# EAGLE design MakePython A9G GPS Tracker V1.1 (EAGLE 6.1)
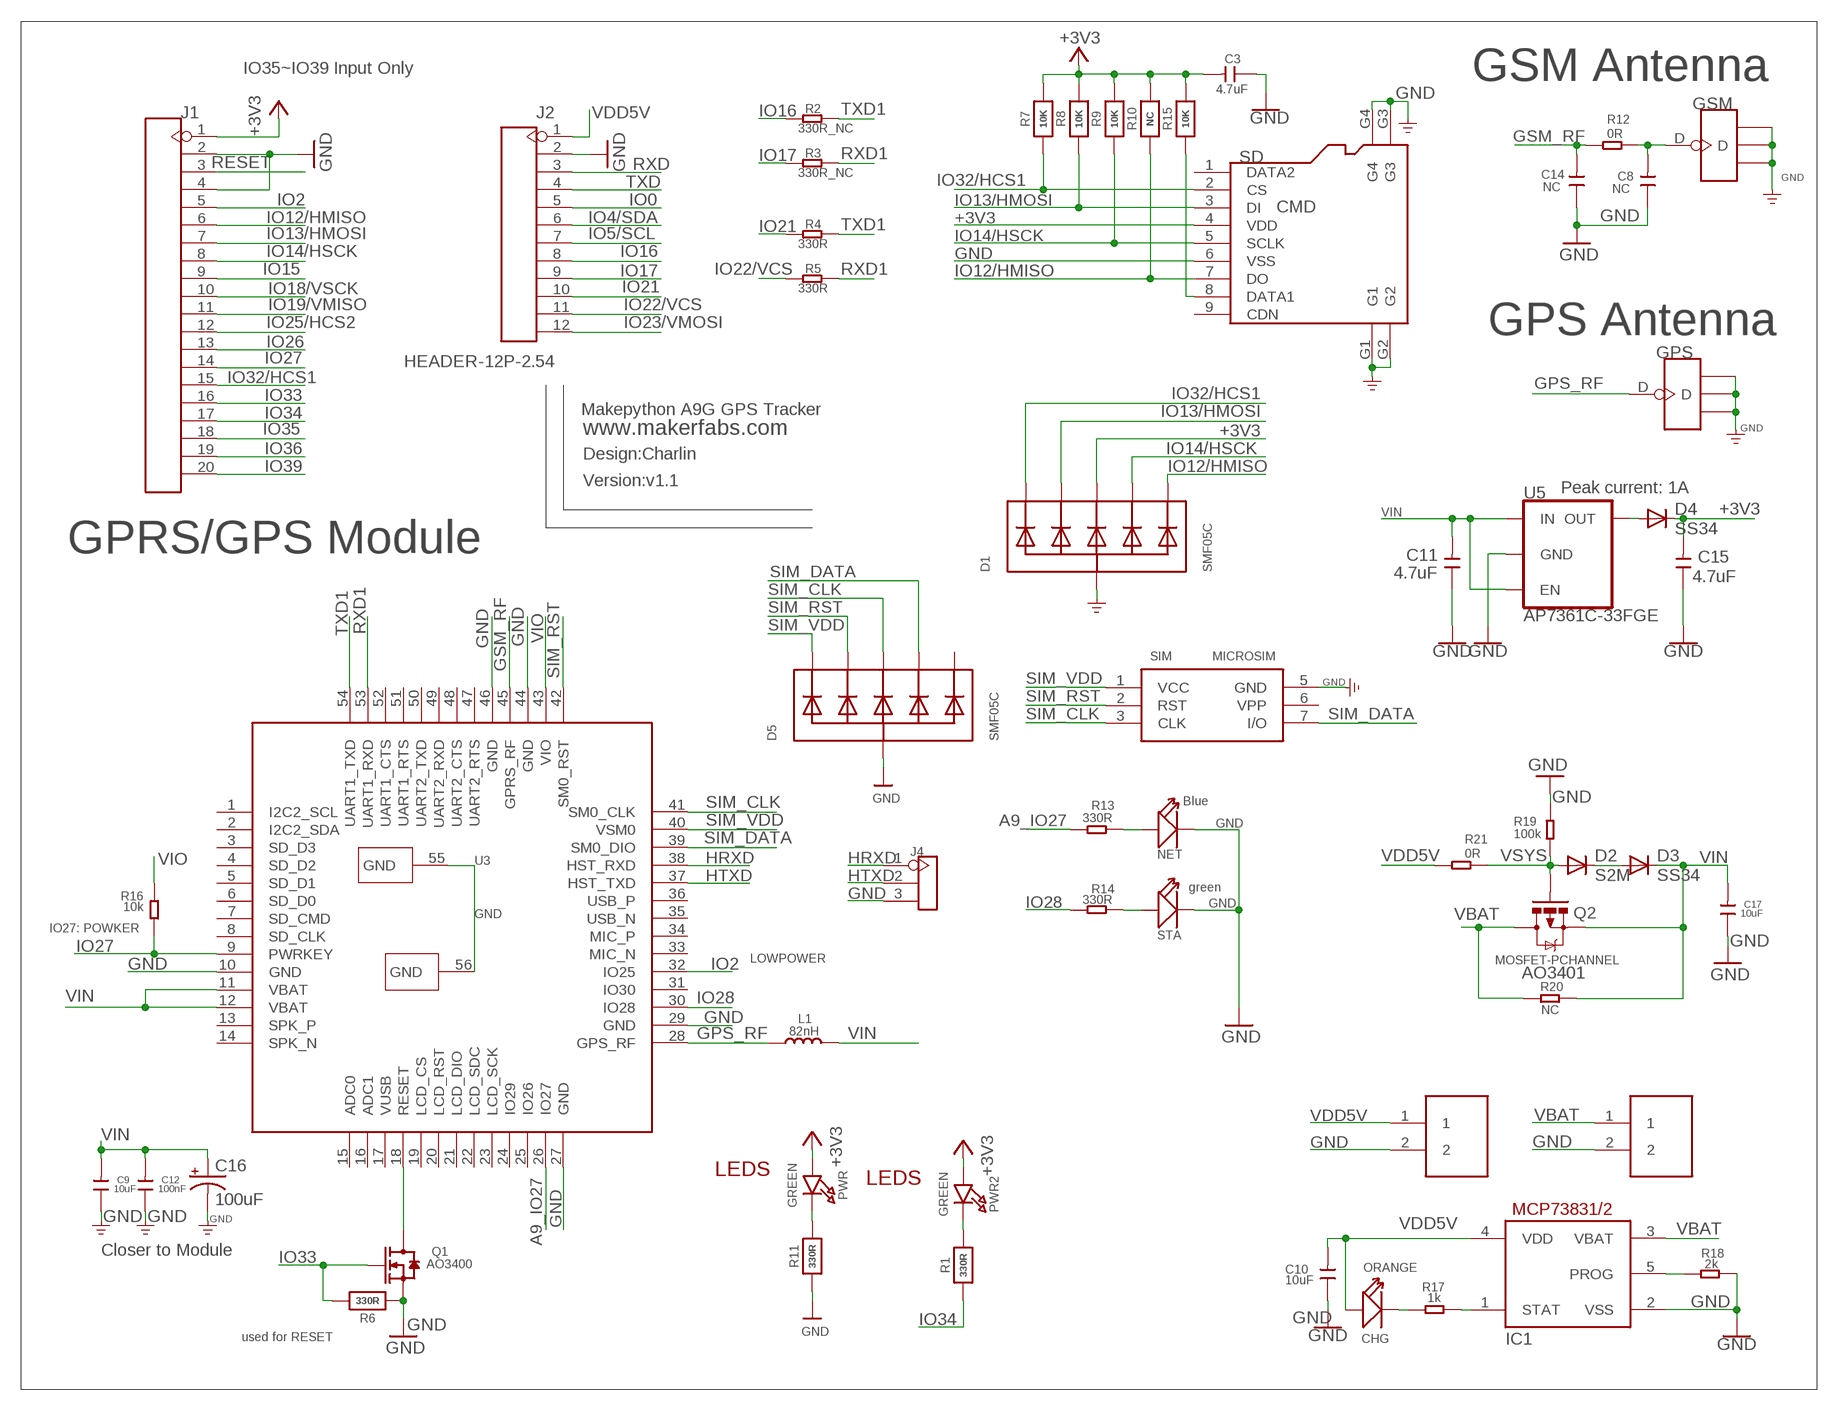
[diagram p0: schematic, sheet 1]

## Parts
BAT  PH2.0-2P-90-DIP  [PH2.0-2P-90-DIP]
C3  4.7uF  DISCRETE_C-0603  [DISCRETE_C0603]
C8  NC  C-0402  [C0402]
C9  10uF  C-0603  [C0603]
C10  10uF  C-0603  [C0603]
C11  4.7uF  C-0603  [C0603]
C12  100nF  C-0603  [C0603]
C14  NC  C-0402  [C0402]
C15  4.7uF  C-0603  [C0603]
C16  100uF  68UF-POLAR-EIA3528-10V-10%(TANT)  [EIA3528]
C17  10uF  C-0603  [C0603]
CHG  ORANGE  007-LED0603  [D0603]
CHRG  PH2.0-2P-90-DIP  [PH2.0-2P-90-DIP]
D1  SMF05C  TVSARRAY_5LANE  [SOT363]
D2  S2M  DIODE-DO-214AC  [DO-214AC]
D3  SS34  DIODE-DO-214AC  [DO-214AC]
D4  SS34  DIODE-DO-214AC  [DO-214AC]
D5  SMF05C  TVSARRAY_5LANE  [SOT363]
GPS  ANTENNA-U-FL  [4P-U-FL]
GSM  ANTENNA-U-FL  [4P-U-FL]
IC1  MCP73831/OT  [SOT23-5L]
J1  HEADER-20P-2.54  [20P-2.54]
J2  HEADER-12P-2.54  [12P-2.54]
J4  HEADER-3P-2.54  [3P-2.54]
L1  82nH  L'0603'  [L0603]
NET  Blue  LED'0603'  [LED-0603]
PWR  GREEN  LED0805_NOOUTLINE  [CHIPLED_0805_NOOUTLINE]
PWR2  GREEN  LED0805_NOOUTLINE  [CHIPLED_0805_NOOUTLINE]
Q1  AO3400  MOSFET-N'SOT23'  [SOT23@1]
Q2  MOSFET-PCHANNEL  [SOT23-3]
R1  330R  RESISTOR_0603_NOOUT  [0603-NO]
R2  330R_NC  R-0603  [R0603]
R3  330R_NC  R-0603  [R0603]
R4  330R  R-0603  [R0603]
R5  330R  R-0603  [R0603]
R6  330R  RESISTOR_0603_NOOUT  [0603-NO]
R7  10K  RESISTOR_0603_NOOUT  [0603-NO]
R8  10K  RESISTOR_0603_NOOUT  [0603-NO]
R9  10K  RESISTOR_0603_NOOUT  [0603-NO]
R10  NC  RESISTOR_0603_NOOUT  [0603-NO]
R11  330R  RESISTOR_0603_NOOUT  [0603-NO]
R12  0R  R-0603  [R0603]
R13  330R  R-0603  [R0603]
R14  330R  R-0603  [R0603]
R15  10K  RESISTOR_0603_NOOUT  [0603-NO]
R16  10k  R-0603  [R0603]
R17  1k  R-0603  [R0603]
R18  2k  R-0603  [R0603]
R19  100k  R-0603  [R0603]
R20  NC  R-0603  [R0603]
R21  0R  R-0603  [R0603]
SD  HOLDER-MICROSD-9P  [9P-SMD-W/-RING]
SIM  MICROSIM  [MICROSIM]
STA  green  LED'0603'  [LED-0603]
U3  A9G  [A9G]
U5  AP7361C-33FGE  [8-UDFN]

## Nets
+3V3: C3.2 C15.2 D1.4(C3) D4.C J1.1 PWR2.A PWR.A R7.2 R8.2 R9.2 R10.2 R15.2 SD.4(VDD)
A9_IO27: R13.1 U3.26(IO27)
GND: BAT.2 C3.1 C8.1 C9.1 C10.1 C11.1 C12.1 C14.1 C15.1 C16.C(-) C17.1 CHRG.2 D1.2(A) D5.2(A) GPS.GND1 GPS.GND2 GPS.GND3 GSM.GND1 GSM.GND2 GSM.GND3 IC1.2(VSS) J1.2 J1.4 J2.2 J4.3 NET.- Q1.2(S) R6.1 R11.1 R18.2 R19.2 SD.6(VSS) SD.G1 SD.G2 SD.G3 SD.G4 SIM.5(GND) STA.- U3.10(GND) U3.27(GND) U3.29(GND) U3.44(GND) U3.46(GND) U3.55(GND) U3.56(GND) U5.4(GND) U5.EP(GND)
GPS_RF: GPS.D L1.1 U3.28(GPS_RF)
GSM_RF: C14.2 R12.1 U3.45(GPRS_RF)
HRXD: J4.1 U3.38(HST_RXD)
HTXD: J4.2 U3.37(HST_TXD)
IO0: J2.5
IO2: J1.5 U3.32(IO25)
IO4/SDA: J2.6 R15.1 SD.8(DATA1)
IO5/SCL: J2.7
IO12/HMISO: D1.6(C5) J1.6 R10.1 SD.7(DO)
IO13/HMOSI: D1.3(C2) J1.7 R8.1 SD.3(DI)
IO14/HSCK: D1.5(C4) J1.8 R9.1 SD.5(SCLK)
IO15: J1.9
IO16: J2.8 R2.1
IO17: J2.9 R3.1
IO18/VSCK: J1.10
IO19/VMISO: J1.11
IO21: J2.10 R4.1
IO22/VCS: J2.11 R5.1
IO23/VMOSI: J2.12
IO25/HCS2: J1.12
IO26: J1.13
IO27: J1.14 R16.1 U3.9(PWRKEY)
IO28: R14.1 U3.30(IO28)
IO32/HCS1: D1.1(C1) J1.15 R7.1 SD.2(CS)
IO33: J1.16 Q1.1(G) R6.2
IO34: J1.17 R1.1
IO35: J1.18
IO36: J1.19
IO39: J1.20
N$1: PWR2.C R1.2
N$2: D4.A U5.1(OUT)
N$3: R14.2 STA.+
N$5: PWR.C R11.2
N$6: D2.C D3.A
N$7: NET.+ R13.2
N$8: Q1.3(D) U3.18(RESET)
N$25: CHG.- R17.1
N$26: IC1.1(STAT) R17.2
N$31: IC1.5(PROG) R18.1
N$94: C8.2 GSM.D R12.2
RESET: J1.3
RXD: J2.3
RXD1: R3.2 R5.2 U3.53(UART1_RXD)
SIM_CLK: D5.4(C3) SIM.3(CLK) U3.41(SM0_CLK)
SIM_DATA: D5.5(C4) SIM.7(I/O) U3.39(SM0_DIO)
SIM_RST: D5.3(C2) SIM.2(RST) U3.42(SM0_RST)
SIM_VDD: D5.1(C1) SIM.1(VCC) U3.40(VSM0)
TXD: J2.4
TXD1: R2.2 R4.2 U3.54(UART1_TXD)
VBAT: BAT.1 IC1.3(VBAT) Q2.3(D) R20.1
VDD5V: C10.2 CHG.+ CHRG.1 IC1.4(VDD) J2.1 R21.1
VIN: C9.2 C11.2 C12.2 C16.A(+) C17.2 D3.C L1.2 Q2.2(S) R20.2 U3.11(VBAT) U3.12(VBAT) U5.5(EN) U5.8(IN)
VIO: R16.2 U3.43(VIO)
VSYS: D2.A Q2.1(G) R19.1 R21.2
Unconnected: D5.6(C5) SD.1(DATA2) SD.9(CDN) SIM.6(VPP) U3.1(I2C2_SCL) U3.2(I2C2_SDA) U3.3(SD_D3) U3.4(SD_D2) U3.5(SD_D1) U3.6(SD_D0) U3.7(SD_CMD) U3.8(SD_CLK) U3.13(SPK_P) U3.14(SPK_N) U3.15(ADC0) U3.16(ADC1) U3.17(VUSB) U3.19(LCD_CS) U3.20(LCD_RST) U3.21(LCD_DIO) U3.22(LCD_SDC) U3.23(LCD_SCK) U3.24(IO29) U3.25(IO26) U3.31(IO30) U3.33(MIC_N) U3.34(MIC_P) U3.35(USB_N) U3.36(USB_P) U3.47(UART2_RTS) U3.48(UART2_CTS) U3.49(UART2_RXD) U3.50(UART2_TXD) U3.51(UART1_RTS) U3.52(UART1_CTS)

## Notes on the sheet
- IO35~IO39 Input Only
- GSM Antenna
- CMD
- GPS Antenna
- Makepython A9G GPS Tracker
- www.makerfabs.com
- Design:Charlin
- Version:v1.1
- Peak current: 1A
- GPRS/GPS Module
- IO27: POWKER
- LOWPOWER
- AO3401
- LEDS
- LEDS
- Closer to Module
- used for RESET

## Library data of the parts
BAT CHRG = Connector:PH2.0-2P-90-DIP
C3 = A9G:DISCRETE_C*: Ceramic Capacitors
C8-C12 C14 C15 C17 = Discrete:C*: Ceramic Capacitors
C16 = SparkFun-Capacitors:68UF-POLAR: 68µF polarized capacitors A capacitor is a passive two-terminal electrical component used to store electrical energy temporarily in an electric field.; PROD_ID: CAP-10790; VALUE: 68uF
CHG = Discrete:007-LED*
D1 D5 = microbuilder:TVSARRAY_5LANE: Voltage Transient Suppressor Array SOT363 SMF05C - 100W 5V: Digikey - SMF05CT1GOSCT-ND
D2-D4 = diode:DIODE-: DIODE
GPS GSM = Connector:ANTENNA-U-FL
IC1 = adafruit:MCP73831: MCP73831/2 Miniature Single-Cell, Fully Integrated Li-Ion, Li-Polymer Charge Management Controllers. Nice and small simple lipoly charge controller, with adjustable current and status output (LED) http://www.ladyada.net/library/pcb/eaglelibrary.html
J1 = Connector:HEADER-20P
J2 = Connector:HEADER-12P
J4 = Connector:HEADER-3P
L1 = Discrete:L*
NET STA = Discrete:LED*
PWR PWR2 = microbuilder:LED: LED 0603 - 0603 Surface Mount Package 2mA: Green LED - Low Power (3.9mcd, 2ma, 1.7Vf) - Digikey: 475-2709-2-ND Orange LED - Low Power (9.8mcd, 2ma, 1.8Vf) - Digikey: 475-1194-2-ND Red LED - Low Power (5mcd, 2ma, 1.8Vf) - Digikey: 475-1195-2-ND Yellow LED - Low Power (7mcd, 2ma, 1.8Vf) - Digikey: 475-1196-2-ND 5mA: Blue LED - Low Power (17mcd, 5ma, 2.9Vf) - Digikey: LNJ937W8CRACT-ND 0805 - 0805 Surface Mount Package 2mA: Red LED (8.8mcd, 2mA, 1.8Vf, Clear) - Low Power [Digikey: 475-2510-1-ND] Green LED (5mcd, 2mA, 1.8Vf, Clear) - Low Power [Digikey: 475-2730-1-ND] Yellow LED (11.3mcd, 2mA, 1.8Vf, Clear) - Low Power [Digikey: 475-2555-1-ND] 20mA: Red LED (104mcd, 20mA, Diffused) - LS R976 [Digikey: 475-1278-6-ND] Red LED (12mcd, 20mA, 2.0Vf, Clear) - APT2012EC [Digikey: 754-1128-1-ND] Green LED (15mcd, 20mA, 2.2Vf, Clear) - APT2012GC [Digikey: 754-1131-1-ND] Orange LED (160mcd, 20mA, 2.1Vf, Clear) - APT2012SECK [Digikey: 754-1130-1-ND] 1206 - 1206 Surface Mount Package Green LED (26mcd, 20mA, Diffused) - LG N971 [Digikey: 475-1407-6-ND] Red LED (15mcd, 20mA, Diffused) - LH N974 [Digikey: 475-1416-6-ND] Cree - Cree High-Power Surface Mount LEDs XPEBWT-L1-0000-00D50 - White 111lm 350mA 2.9Vf 6200K 110° XTEAWT-00-0000-00000LEE3 - White 114lm 350mA 2.85Vf 5000K 115° Everlight - Everlight 45-21 Series Surface Mount LEDs 45-21/QK2C-B2832AC2CB2/2T - Warm White 2000mcd 20mA 3.25Vf 3050K 120° 45-21/LK2C-B38452C4CB2/2T - Nuetral White 2000mcd 20mA 3.25Vf 4150K 120° 45-21/LK2C-B50634C6CB2/2T - Cold White 2200mcd 20mA 3.25Vf 5650K 120° PLCC2 Reverse Mount LS T77K-J1L2-1-0-2-R18-Z - Red 11.25mcd 2mA 1.8Vf 630nm 120° LO T77K-L1M2-24-Z - Orange 19.6mcd 2mA 1.8Vf 606nm 120° LY T77K-K2M1-26-Z - Yellow 15.7mcd 2mA 1.8Vf 587nm 120°
Q1 = Discrete:MOSFET-N: IRLL014: http://www.vishay.com/docs/91319/sihll014.pdf
Q2 = User-Submitted:MOSFET-PCHANNEL: Generic PMOSFET IRLML2244 - TRANS-11153 (SOT-23 -20V -4.3A) (1.Gate 2.Source 3.Drain) FQP27P06 - COM-10349 <http://www.sparkfun.com/products/10349> (TO-220 -60V -27A) (1.Gate 2.Source 3.Drain); PROD_ID: TRANS-08285
R1 R6-R11 R15 = microbuilder:RESISTOR: Resistors For new designs, use the packages preceded by an '_' character since they are more reliable: The following footprints should be used on most boards: _0402 - Standard footprint for regular board layouts _0603 - Standard footprint for regular board layouts _0805 - Standard footprint for regular board layouts _1206 - Standard footprint for regular board layouts For extremely tight-pitch boards where space is at a premium, the following 'micro-pitch' footprints can be used (smaller pads, no silkscreen outline, etc.): _0402MP - Micro-pitch footprint for very dense/compact boards _0603MP - Micro-pitch footprint for very dense/compact boards _0805MP - Micro-pitch footprint for very dense/compact boards _1206MP - Micro-pitch footprint for very dense/compact boards
R2-R5 R12-R14 R16-R21 = Discrete:R*
SD = Connector:HOLDER-MICROSD-9P
SIM = Connector:MICROSIM
U3 = A9G:A9G
U5 = ublox:AP7361C-33FGE: AP7361C 3.3V LDO Regulator; PROD_ID: VREG-14094

## Net classes
0 default: width 0.203 mm, drill 0.305 mm, clearance 0.152 mm
2 gnd: width 0.305 mm, drill 0.559 mm, clearance 0.254 mm
3 usbvcc: width 0.508 mm, drill 0.61 mm, clearance 0.254 mm

## Board
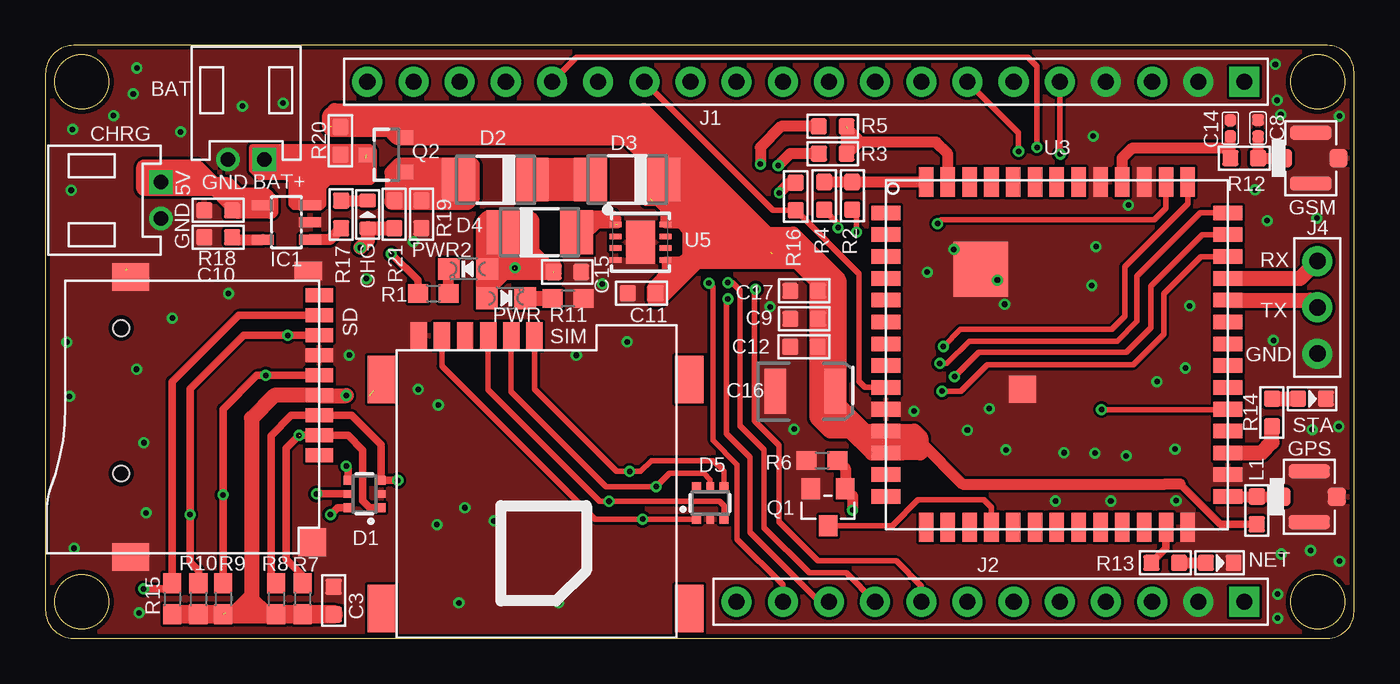
[diagram p1: board, top side]
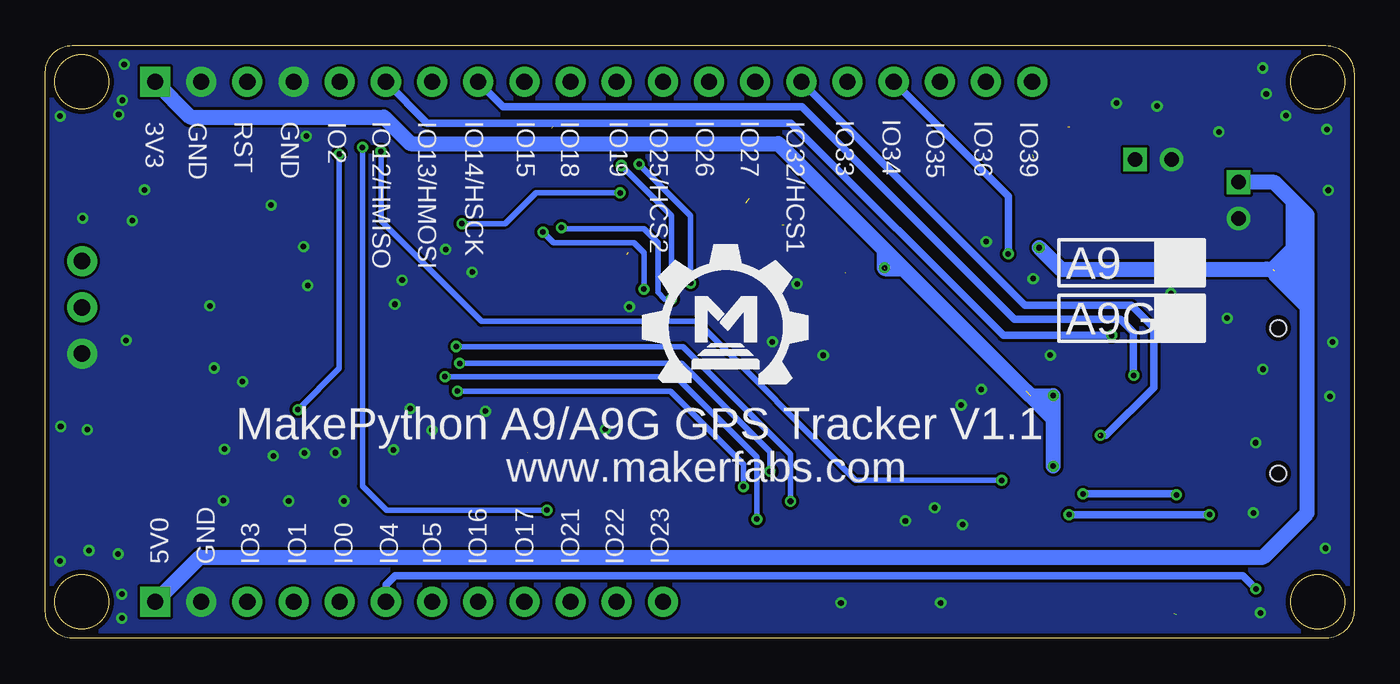
[diagram p2: board, bottom side, seen from below]

Size 72 x 32.6 mm. Coordinates in mm from the lower left corner, seen from the top.
Outline: 1.55,0 70.53,0 arc90 72,1.47 72,31.12 arc90 70.52,32.6 1.55,32.6 arc90 0,31.05 0,1.55 arc90 1.55,0
Outline: circle at 70,2 radius 1.5
Outline: circle at 70,30.6 radius 1.5
Outline: circle at 2,2 radius 1.5
Outline: circle at 2,30.6 radius 1.5
Copper layers (1*16): Top 0.035mm / dielectric 1.5mm / Bottom 0.035mm
Design rules: minimum track width 6mil, minimum drill 12mil, track to track 6mil, track to pad 6mil, pad to pad 6mil, via to via 6mil, smd to smd 0mil, copper to edge 10mil, drill to drill 10mil, minimum pad ring 10mil, minimum via ring 6mil, stop-mask expansion 2mil, vias tented up to drill 100mil, thermal gap 0mil

### Footprints (pad centres in the part's own frame; a part is rotated, then mirrored left to right if it is on the bottom)
PH2.0-2P-90-DIP = drill 0.8 square: 1 0,1 | drill 0.8: 2 0,-1
DISCRETE_C0603 = smd 0.889 x 0.889: 1 -0.762,0; 2 0.762,0
C0402 = smd 0.635 x 0.635: 1 -0.445,0; 2 0.445,0
C0603 = smd 0.889 x 0.889: 1 -0.762,0; 2 0.762,0
EIA3528 = smd 1.2 x 2.5: A 1.65,0; C -1.65,0
D0603 = smd 0.762 x 0.889: + -0.762,0; - 0.762,0
SOT363 = smd 0.5 x 0.5: 1 -0.75,-0.9; 3 0.75,-0.9; 4 0.75,0.9; 6 -0.75,0.9 | smd 0.4 x 0.5: 2 0,-0.9; 5 0,0.9
DO-214AC = smd 1.8 x 2.4: A 2.025,0; C -2.025,0
4P-U-FL = smd 1.016 x 1.016: D -1.524,0; GND3 1.524,0 | smd 2.286 x 0.762: GND1 0,1.397; GND2 0,-1.397
SOT23-5L = smd 0.55 x 1.2: 1 -0.95,-1.3; 2 0,-1.3; 3 0.95,-1.3; 4 0.95,1.3; 5 -0.95,1.3
20P-2.54 = drill 0.889 pad 1.651 square: 1 -25.4,0 | drill 0.889 pad 1.651: 2 -22.86,0; 3 -20.32,0; 4 -17.78,0; 5 -15.24,0; 6 -12.7,0; 7 -10.16,0; 8 -7.62,0; 9 -5.08,0; 10 -2.54,0; 11 0,0; 12 2.54,0; 13 5.08,0; 14 7.62,0; 15 10.16,0; 16 12.7,0; 17 15.24,0; 18 17.78,0; 19 20.32,0; 20 22.86,0
12P-2.54 = drill 0.889 pad 1.651 square: 1 0,13.97 | drill 0.889 pad 1.651: 2 0,11.43; 3 0,8.89; 4 0,6.35; 5 0,3.81; 6 0,1.27; 7 0,-1.27; 8 0,-3.81; 9 0,-6.35; 10 0,-8.89; 11 0,-11.43; 12 0,-13.97
3P-2.54 = drill 0.9 pad 1.651: 1 0,2.54; 2 0,0; 3 0,-2.54
L0603 = smd 0.889 x 0.889: 1 -0.762,0; 2 0.762,0
LED-0603 = smd 0.889 x 0.889: + -0.762,0; - 0.762,0
CHIPLED_0805_NOOUTLINE = smd 1.2 x 1.2: A 0,-1.05; C 0,1.05
SOT23@1 = smd 1.016 x 1.143: 1 -0.95,-1.016; 2 0.95,-1.016; 3 0,1.016
SOT23-3 = smd 0.8 x 0.9: 1 -0.95,-1; 2 0.95,-1; 3 0,1.1
0603-NO = smd 1.1 x 1: 1 -0.85,0; 2 0.85,0
R0603 = smd 0.889 x 0.889: 1 -0.762,0; 2 0.762,0
9P-SMD-W/-RING = smd 1.524 x 0.762: 1 0,4.4; 2 0,3.3; 3 0,2.2; 4 0,1.1; 5 0,0; 6 0,-1.1; 7 0,-2.2; 8 0,-3.3; 9 0,-4.4 | smd 1.524 x 1.016: G1 0.6,-5.746 | smd 2.032 x 1.524: G2 10.373,-5.4; G3 10.373,10 | smd 1.524 x 1.524: G4 0.392,9.181 | hole 0.889: 10.9,-2.6; 10.9,5.4
MICROSIM = smd 1.5 x 0.9: 1 -0.8,2.5; 2 -0.8,5.04; 3 -0.8,7.58; 5 -0.8,1.23; 6 -0.8,3.77; 7 -0.8,6.31 | smd 2.61 x 1.56: P$1 1.6,-0.8; P$2 14.2,-0.8; P$3 14.2,16.1; P$4 1.6,16.1
A9G = smd 1.6 x 0.8: 1 -9.4,7.8; 2 -9.4,6.6; 3 -9.4,5.4; 4 -9.4,4.2; 5 -9.4,3; 6 -9.4,1.8; 7 -9.4,0.6; 8 -9.4,-0.6; 9 -9.4,-1.8; 10 -9.4,-3; 11 -9.4,-4.2; 12 -9.4,-5.4; 13 -9.4,-6.6; 14 -9.4,-7.8; 28 9.4,-7.8; 29 9.4,-6.6; 30 9.4,-5.4; 31 9.4,-4.2; 32 9.4,-3; 33 9.4,-1.8; 34 9.4,-0.6; 35 9.4,0.6; 36 9.4,1.8; 37 9.4,3; 38 9.4,4.2; 39 9.4,5.4; 40 9.4,6.6; 41 9.4,7.8 | smd 0.8 x 1.6: 15 -7.2,-9.5; 16 -6,-9.5; 17 -4.8,-9.5; 18 -3.6,-9.5; 19 -2.4,-9.5; 20 -1.2,-9.5; 21 0,-9.5; 22 1.2,-9.5; 23 2.4,-9.5; 24 3.6,-9.5; 25 4.8,-9.5; 26 6,-9.5; 27 7.2,-9.5; 42 7.2,9.5; 43 6,9.5; 44 4.8,9.5; 45 3.6,9.5; 46 2.4,9.5; 47 1.2,9.5; 48 0,9.5; 49 -1.2,9.5; 50 -2.4,9.5; 51 -3.6,9.5; 52 -4.8,9.5; 53 -6,9.5; 54 -7.2,9.5 | smd 3 x 3: 55 -4.2,4.7 | smd 1.5 x 1.5: 56 -1.9,-1.9
8-UDFN = smd 0.3 x 0.65: 1 -0.975,-1.375; 2 -0.325,-1.375; 3 0.325,-1.375; 4 0.975,-1.375; 5 0.975,1.375; 6 0.325,1.375; 7 -0.325,1.375; 8 -0.975,1.375 | smd 2.35 x 1.6: EP 0,0

### Placement (x,y rotation side)
BAT  11.05,26.32 270 top
C3  15.85,2.07 270 top
C8  66.71,28.05 270 top
C9  41.74,17.56 0 top
C10  9.51,23.53 0 top
C11  32.8,18.97 0 top
C12  41.74,16.03 0 top
C14  65.19,28.04 270 top
C15  28.72,20.14 180 top
C16  41.8,13.58 0 top
C17  41.75,19.1 0 top
CHG  17.73,23.31 90 top
CHRG  6.35,24.08 0 top
D1  17.56,7.93 90 top
D2  24.76,25.22 180 top
D3  32.01,25.22 180 top
D4  27.19,22.32 0 top
D5  36.58,7.44 0 top
GPS  69.53,7.78 0 top
GSM  69.62,26.4 0 top
IC1  13.26,22.87 90 top
J1  40.57,30.6 180 top
J2  52,2 270 top
J4  69.98,18.2 0 top
L1  66.65,7.03 270 top
NET  64.61,4.15 0 top
PWR  25.34,18.7 270 top
PWR2  23.24,20.31 90 top
Q1  43.06,7.2 180 top
Q2  18.77,26.58 90 top
R1  21.34,18.96 0 top
R2  44.39,24.33 90 top
R3  43.32,26.65 0 top
R4  42.85,24.33 90 top
R5  43.32,28.15 0 top
R6  42.73,9.78 0 top
R7  14.15,2.17 270 top
R8  12.7,2.16 270 top
R9  9.77,2.16 270 top
R10  8.42,2.17 270 top
R11  28.75,18.69 180 top
R12  65.95,26.4 0 top
R13  61.61,4.14 0 top
R14  67.48,12.41 90 top
R15  6.98,2.16 270 top
R16  41.28,24.3 90 top
R17  16.27,23.31 270 top
R18  9.51,22.05 180 top
R19  20.69,23.31 270 top
R20  16.23,27.35 90 top
R21  19.19,23.31 90 top
SD  15.07,14.46 180 top
SIM  19.32,15.82 270 top
STA  69.69,13.18 0 top
U3  55.65,15.59 0 top
U5  32.74,21.77 270 top
U$1  [MAKERFABS_0.3]  38.69,14.03 0 bottom

### Tracks (layer width: path | path; a pad name or v marks a point on that pad's centre or on a via)
+3V3  (via drill 0.3)  (5 unrouted)
  Top 0.406: D1.4 16.66,9.36 v16.55,9.46 | SD.4 15.08,13.35
  Top 0.813: SD.4 12.59,13.36 11.34,12.11 11.34,1.36 11.38,1.31 | 15.08,13.35 v16.55,13.35 | C15.2 26.07,20.14 v25.84,20.37 25.77,20.31 25.16,20.31 | PWR.A PWR2.A 25.16,20.31 | D4.C 25.17,20.73 25.18,20.71 25.18,20.33 25.16,20.31 | 9.92,1.37 10.41,1.37 11.33,2.29 11.33,2.18 12.14,1.36 | 24.3,18.57 24.22,18.57 24.09,18.69 24.09,22.87 24.34,23.11 26.63,23.11 26.76,22.98 26.76,21.25 27.58,20.43 27.99,20.43 27.99,20.11 27.98,20.1 25.21,20.1 24.46,19.35 24.46,18.6 24.45,18.61 24.45,21.05 24.83,20.66 26.73,20.66 26.24,21.15 25.54,21.15 26.35,21.95 26.35,22.58
  Top 1.016: R15.2 R10.2 R9.2 | R9.2 | R9.2 11.38,1.31 R8.2 R7.2 14.16,1.31 C3.2
  Bottom 0.813: J1.1 64.03,28.66 53.38,28.66 51.92,27.2 31.67,27.2 25.36,20.89 | v16.55,9.46 v16.55,13.35 17.81,13.35 25.36,20.89 | v25.84,20.37 25.84,20.41 25.36,20.89 | 16.56,12.15 16.61,12.15 18.06,13.6 | 25.82,20.33 24.83,20.33 24.82,20.33 | 25.84,20.39 25.84,21.3 25.81,21.34
A9_IO27
  Top 0.406: U3.26 61.65,4.94 R13.1
GND  (via drill 0.3)
  other vias: 41.19,11.49 47.79,12.49 29.21,15.56 30.64,19.48 20.24,21.81 20.51,13.68 24.68,6.45 32,16.29 21.54,6.25 21.62,12.82 1.33,13.3 1.17,16.29 23.08,7.17 1.42,24.64 5.15,1.39 1.58,4.95 5.41,10.75 5.01,14.79 6.98,17.6 5.54,6.89 10.08,18.96 1.49,27.98 3.75,28.74 5.03,31.36 4.83,29.94 7.44,27.85 10.84,29.26 13.08,29.43 48.52,20.13 52.85,10.36 56.04,10.2 57.75,10.18 59.46,10.03 61.15,14.11 67.67,31.56 67.77,29.59 67.97,28.8 71.2,28.71 67.22,22.96 69.95,23.11 57.65,27.61 66.55,24.66 67.8,1.1 67.8,2.43 68,4.63 69.6,4.82 71.2,4.24 71.16,11.64 69.7,11.47 67.56,16.38 59.59,23.81 57.56,19.4 52.78,18.37 22.75,1.94 28.23,1.94 39.87,18.22 16.71,15.56 17.66,19.77 58.62,7.55 62.21,7.57 55.57,7.55 51.93,12.63 50.73,11.44 62.96,18.28 62.73,14.86 62.15,10.4 52.38,19.69 57.8,21.54 49.98,21.38
  pour Top: -5.66,35.54 77.89,35.54 77.89,-6.29 -5.66,-6.29 -5.66,35.54
  pour Bottom: -5.61,35.58 77.93,35.58 77.93,-6.25 -5.61,-6.25 -5.61,35.58
GPS_RF
  Top 0.406: L1.1
  Top 0.61: U3.28 L1.1 GPS.D
GSM_RF
  Top 0.406: C14.2
  Top 0.61: R12.1 65.19,27.08 | 65.19,27.08 C14.2 | U3.45 59.25,26.41 59.81,26.97 65.09,26.97 65.19,27.08
HRXD
  Top 0.813: U3.38 69.04,19.79 J4.1
HTXD
  Top 0.813: U3.37 69.59,18.59 J4.2
IO2  (via drill 0.3)
  Top 0.305: J1.5 55.81,26.65 v55.83,26.62 | v58.11,12.57 65.03,12.57 U3.32
  Bottom 0.305: v55.83,26.62 55.83,14.85 v58.11,12.57
IO4/SDA  (via drill 0.3)
  Top 0.406: SD.8 10.62,17.76 6.98,14.12 | 6.98,14.12 6.97,14.11 | 6.98,14.12 R15.1 6.68,2.71 v5.4,2.71
  Bottom 0.406: J2.6 53.27,2.93 52.76,3.44 6.12,3.44 v5.4,2.71
IO12/HMISO  (via drill 0.3)
  Top 0.406: SD.7 v13.34,16.66 10.9,16.66 7.96,13.71 v7.96,6.79 | D1.6 16.07,7.18 v15.69,6.8 | R10.1 8.42,3.72 7.96,4.18 v7.96,6.79 | v7.96,6.79 v7.96,6.8
  Bottom 0.406: v15.69,6.8 v7.96,6.8 | J1.6 50.99,28.32 30.97,28.32 19.3,16.66 v13.34,16.66 | v7.96,6.8
IO13/HMOSI  (via drill 0.3)
  Top 0.305: v19.38,8.68 v19.39,8.68 | J1.7 53.54,27.79 v53.54,26.78
  Top 0.406: D1.3 18.46,10.65 16.85,12.26 SD.3 13.53,12.26 12.41,11.14 12.41,3.31 R8.1 | D1.3 | v19.39,8.68 D1.3
  Bottom 0.305: v19.39,8.68 27.42,8.68 36.16,17.42 48.01,17.42 53.54,22.95 v53.54,26.78
IO14/HSCK  (via drill 0.3)
  Top 0.305: 11.63,14.46 v12.12,14.46 v12.13,14.46
  Top 0.406: SD.5 11.63,14.46 9.77,12.6 v9.77,7.88 R9.1 | D1.5 v14.92,7.93 v14.91,7.93
  Bottom 0.406: v14.91,7.93 9.83,7.93 v9.77,7.88 | J1.8 46.81,29.22 30.37,29.22 18.68,17.53 12.86,17.53 12.15,16.82 12.15,14.48 v12.13,14.46
IO16  (via drill 0.3)
  Top 0.305: J2.8 48.19,2.87 46.81,4.25 42.51,4.25 40.35,6.41 40.35,10.62 39,11.97 39,19.13 v39.08,19.2 | v44.62,22.33 44.62,23.34 R2.1
  Bottom 0.305: v39.08,19.2 39.08,21.21 39.63,21.76 44.05,21.76 v44.62,22.33
IO17  (via drill 0.3)
  Top 0.305: J2.9 44.06,3.59 42.71,3.59 42.03,3.59 39.53,6.09 39.53,10.38 38.23,11.68 38.23,19.14 37.8,19.56 v37.54,19.56
  Top 0.61: R3.1 40.97,26.65 v40.32,26
  Bottom 0.305: v40.32,26 37.54,23.22 v37.54,19.56
IO21  (via drill 0.3)
  Top 0.305: J2.10 42.58,2 38.76,5.82 38.76,9.95 37.46,11.24 37.46,18.57 v37.55,18.65 | R4.1 43.61,22.8 v43.61,22.58
  Bottom 0.305: v37.55,18.65 37.93,18.65 38.3,19.02 38.3,21.76 39.08,22.53 43.56,22.53 v43.61,22.58
IO22/VCS  (via drill 0.3)
  Top 0.305: v36.5,19.53 36.74,19.3 36.74,10.87 38.06,9.55 38.06,5.44 40.57,2.93 J2.11
  Top 0.61: R5.1 40.48,28.15 39.33,27 v39.33,26.07
  Bottom 0.305: v39.33,26.07 36.5,23.24 v36.5,19.53
IO27
  Top 0.305: U3.9 45.1,13.79 44.76,14.14 44.76,20.06 R16.1 40.02,23.53 J1.14
IO28
  Top 0.813: U3.30 66.91,10.19 67.48,10.77 R14.1
IO32/HCS1  (via drill 0.3)  (1 unrouted)
  Top 0.406: R7.1 14.14,3.43 13.25,4.33 13.25,10.46 v13.95,11.15 | 14,11.15 SD.2 16.64,11.16 17.46,10.34 17.46,7.56 17.84,7.18 D1.1 | D1.1
  Bottom 0.406: J1.15 18.11,18.3 12.25,18.3 11.01,17.07 11.01,13.79 13.64,11.15 v13.95,11.15
IO33  (via drill 0.3)
  Top 0.305: J1.16 29.21,31.94 54.06,31.94 54.55,31.45 v54.55,27 | v54.55,27
  Top 0.61: R6.2 44.01,9.35 Q1.1 44.41,7.82 v44.41,7.04
  Bottom 0.305: v54.55,27 54.55,8.36 53.23,7.04 v44.41,7.04
IO34  (via drill 0.3)
  Top 0.406: v19.03,21.14 20.49,19.67 R1.1
  Bottom 0.406: J1.17 19.03,24.3 v19.03,21.14
N$1
  Top 0.61: R1.2 PWR2.C
N$2  (1 unrouted)
  Top 0.406: U5.1 29.64,22.75 D4.A | 29.72,21.56 29.72,22.07 30.4,22.75 31.48,22.75 31.48,23.1 31.26,23.32 29.68,23.32 29.87,23.13 29.87,23.09 29.94,23.02 31.16,23.02
N$3
  Top 0.813: R14.2 STA.+
N$5
  Top 0.813: PWR.C 26.4,18.69 R11.2
N$6
  Top 0.406: D3.A
  Top 0.813: 26.67,24.84 27.08,24.43 30.36,24.43 30.42,24.49 30.42,25.99 30.4,26.01 26.3,26.01 26.3,25.43 26.51,25.22 27.35,25.22
  Top 1.016: D2.C 27.35,25.22 D3.A
N$7
  Top 0.305: NET.+
  Top 0.61: R13.2 NET.+
N$8
  Top 0.305: U3.18 52.05,7.19 51.63,7.61 48.01,7.61 46.59,6.18 Q1.3
N$25
  Top 0.406: CHG.-
  Top 0.61: R17.1 CHG.-
N$26
  Top 0.61: R17.2 15.64,21.92 IC1.1
N$31
  Top 0.61: R18.1 10.4,21.92 IC1.5
N$94
  Top 0.406: GSM.D | R12.2
  Top 0.61: R12.2 GSM.D | C8.2 R12.2
RXD1  (1 unrouted)
  Top 0.61: R3.2 44.08,27.16 | 44.08,27.16 R5.2 | U3.53 49.65,26.64 48.99,27.29 44.2,27.29 44.08,27.16 | 44.12,28.04 44.12,28.03 44.81,27.34 44.81,27.32 44.21,26.73
SIM_CLK  (via drill 0.3)
  Top 0.305: SIM.3 26.9,13.69 31.41,9.18 v32.14,9.18 32.74,9.18 33.34,9.77 36.73,9.77 37.33,9.17 D5.4 | v49.21,15.12 49.6,15.12 50.82,16.34 58.98,16.34 60.06,17.42 60.06,19.9 63.55,23.39 U3.41
  Bottom 0.305: v49.21,15.12 37.01,15.12 32.14,10.25 v32.14,9.18
SIM_DATA  (via drill 0.3)
  Top 0.305: SIM.7 25.63,13.56 30.85,8.34 v33.6,8.34 34.33,9.07 36.23,9.07 36.58,8.72 D5.5 | v49.33,13.58 50.37,13.58 51.83,15.04 59.86,15.04 61.52,16.71 61.52,18.94 63.57,20.99 U3.39
  Bottom 0.305: v49.33,13.58 37.62,13.58 33.6,9.57 v33.6,8.34
SIM_RST  (via drill 0.3)
  Top 0.305: v49.4,16.04 50.34,16.98 58.66,16.98 59.38,17.7 59.38,20.43 62.85,23.9 U3.42 | SIM.2 24.36,13.66 30.49,7.53 v31.01,7.53 37.1,7.53 37.33,7.3 D5.3
  Bottom 0.305: v49.4,16.04 36.93,16.04 31,10.11 v31,7.53 v31.01,7.53
SIM_VDD  (via drill 0.3)
  Top 0.305: v50.02,14.39 51.35,15.72 59.46,15.72 60.81,17.07 60.81,19.35 63.65,22.19 U3.40 | SIM.1 21.82,14.96 30.24,6.54 v32.85,6.54 D5.1
  Bottom 0.305: v50.02,14.39 37.3,14.39 32.86,9.94 v32.86,6.55 v32.85,6.54
TXD1
  Top 0.61: R4.2 R2.2 U3.54
VBAT  (1 unrouted)
  Top 0.406: BAT.1 14.51,26.32 | 14.51,26.32 15.96,26.32 R20.1 17.66,26.59 Q2.3 | IC1.3 14.56,26.27 14.51,26.32 | 18.02,26.8 17.84,26.98 11.41,26.98 11.41,25.76 11.75,25.41 13.33,25.41 13.58,25.16 13.58,23.86 13.69,23.75 15.14,23.75 15.25,23.86 15.25,24.81 15.57,25.13 17.89,25.13 18.02,25.26 18.02,26.8 17.6,26.38 17.6,26.28
  Top 0.813: 17.6,26.28 17.58,26.26 17.58,25.57 17.57,25.57 15.21,25.57 14.82,25.18 14.82,24.39 14.64,24.21 13.99,24.21 14.06,24.27 14.06,25.38 13.55,25.89 11.9,25.89 11.88,25.9 11.88,26.53 11.89,26.52 16.73,26.52 17.06,26.2 | 17.06,26.2 | 17.06,26.2 16.85,25.99 13.89,25.99
VDD5V  (via drill 0.3)  (1 unrouted)
  Top 0.406: CHRG.1 8.72,25.08 C10.2 11.67,23.53 IC1.4 | R21.1
  Top 0.762: R21.1 CHG.+ 17.73,21.88 v17.33,21.47
  Top 0.813: 5.43,25.92 8.3,25.92 9.85,24.38 12.08,24.38 12.4,24.06 12.4,23.48 10.62,23.48 10.38,23.71 | 10.38,23.71 10.08,24.01 11.07,24.01 11.24,23.84 10.26,23.84 9.22,24.87 9.23,24.87 | 9.23,24.87 9.37,24.73 5.42,24.73 5.41,24.73 5.41,25.9 5.44,25.93 5.48,25.93 6.05,25.36 8.2,25.36 8.27,25.29 8.27,25.33 8.3,25.35 | 10.84,24.13 10.04,24.93 9.22,24.93 | 9.22,24.93 9.07,24.93 | C10.2 10.38,23.64 10.38,23.71 | 9.23,24.87 9.22,24.88 9.22,24.93
  Bottom 0.813: CHRG.1 6.34,25.07 4.38,25.07 2.58,23.26 2.58,22.27 2.58,22.17 | J2.1 63.51,4.46 5,4.46 2.58,6.88 2.58,22.17 | v17.33,21.47 16.14,20.29 3.29,20.29 | 3.29,20.29 3.2,20.29 | 3.29,21.46 4.46,20.29 4.57,20.29 | 4.83,20.29 4.57,20.29 | 4.57,20.29 3.26,18.98 | 3.29,21.46 3.29,20.29 | 3.29,21.46 2.58,22.17 | 4.38,20.2 4.38,20.05 2.62,18.29 2.62,19.25 3.34,19.96 3.34,23.9
VIN  (4 unrouted)
  Top 0.305: 33.48,23.92 33.02,23.92 33.02,26.06 33.03,26.06 | U3.12 U3.11 44.07,11.39 43.45,12.02 C16.A 43.45,15.07 C12.2 42.5,17.55 C9.2 C17.2 | C17.2 | C17.2 42.51,20.21 41.61,21.11 39.65,21.11 39.53,21.22
  Top 0.406: R20.2 19.19,28.11 Q2.2 31.72,27.53 D3.C 34.04,22.82 U5.8 38.37,22.75 40.01,21.11 39.69,20.8 U5.5 34.11,19.52 C11.2 | L1.2 64.64,6.27 62.43,8.48 | 61.6,8.48
  Top 0.61: 61.6,8.48 50.45,8.48 48.17,10.77 46.87,10.77 | 62.43,8.48 61.6,8.48
  Top 0.813: 15.64,28.14 15.64,28.75 15.91,29.02 32.91,29.02 39.71,22.22 41.14,22.22 43.65,19.71 43.65,12.81 45.08,11.38 47.81,11.38 48.16,11.03 48.16,10.21 48.14,10.2 45.46,10.2 45.46,10.66 44.73,11.39 43.19,11.39 42.46,12.12 42.46,19.64 41.39,20.71 35.83,20.71 33.77,18.65 33.5,18.65 33.5,19.24 34.37,20.12 34.66,20.12 35.47,20.93 35.47,22.47 34.99,22.95 34.97,22.95 33.74,24.17 33.28,24.17 33.45,24.34 33.45,27.94 32.82,28.56 32.65,28.56 32.6,28.6 16.21,28.6 16.66,28.15 18.86,28.15 18.86,28.03 19.36,27.54 33.52,27.54 37.68,23.37 36.88,23.37 35.61,24.64 36.22,24.64 39.2,21.65 41.05,21.65 41.44,21.26 41.44,21.2 42.97,19.67 42.97,12.64 43.78,11.83 44.5,11.83 45.57,10.77 46.87,10.77 47.58,10.77 47.65,10.69 47.77,10.69 48.02,10.45 46.84,10.45 46.34,10.95 | 47.24,10.29 47.14,10.2 45.46,10.2 44.21,11.45 43.68,11.45 43.7,11.45
  Top 1.016: 39.92,21.22 39.53,21.22 35.87,21.22 33.97,19.33 34.13,19.33 34.54,19.74 34.54,20.22 34.48,20.28 34.92,20.28 35.77,21.12 35.77,22.07 35.74,22.09 38.85,22.09 38.89,22.06 36.14,22.06 35.7,22.5 37.76,22.5 38.23,22.98 36.36,22.98 36.13,23.21 34.6,23.21 34.52,23.3 34.52,23.67 34.55,23.7 35.85,23.7 35.88,23.73 35.88,23.76 35.14,24.5 35.14,25.86 33.16,27.85 33.16,27.11 33.69,26.58 33.41,26.58 32.37,27.63 32.37,27.83 32.47,27.93 19.45,27.93 19.36,27.84 19.27,27.84 19.05,28.06 15.81,28.06 15.74,28.13
VIO  (via drill 0.3)
  Top 0.305: U3.43 61.65,23.65 61.02,23.03 49.31,23.03 v49.08,22.8
  Top 0.61: R16.2 40.94,25.06 v40.38,24.5
  Bottom 0.305: v49.08,22.8 46.71,22.8 45.02,24.5 v40.38,24.5
VSYS
  Top 0.406: R21.2 19.75,24.07 | 19.75,24.07 R19.1 21.59,24.07 D2.A | Q2.1 19.77,24.09 19.75,24.07
  Top 0.813: 19.59,25.21 21.33,25.21 21.56,25.44 21.56,24.45 21.55,24.43 19.3,24.43 19.23,24.36 19.23,24.11 R21.2 19.07,24.06 | 19.08,23.97 23.22,23.97 23.49,24.24 23.49,26 23.48,26.01 19.46,26.01 19.07,25.62 19.07,24.06 | 19.07,24.06 19.07,23.98

### Text on the board
tPlace: RX | TX | GND
bPlace: IO34 | IO33 | IO39 | IO36 | IO35 | IO32/HCS1 | IO27 | IO26 | IO25/HCS2 | IO19 | IO18 | IO15 | IO14/HSCK | IO13/HMOSI | IO12/HMISO | IO2 | GND | RST | GND | 3V3 | MakePython A9/A9G GPS Tracker V1.1 | www.makerfabs.com | IO23 | IO22 | IO21 | IO17 | IO16 | IO5 | IO4 | IO0 | IO1 | IO3 | GND | 5V0
tNames: GND | BAT+ | 5V | GND
bNames: A9 | A9G